# EasyEDA Pro project ProProject_quadcopter-FWB_2024-12-04.epro

# Schematic circuit_diagram_controller
Create Date: 2023-06-08; Page Name: diagram; Project Name: quadcopter-FWB; Schematic Name: circuit_diagram_controller; Update Date: 2023-06-11; Company: 嘉立创EDA; Page Size: A4; Version: V1.0
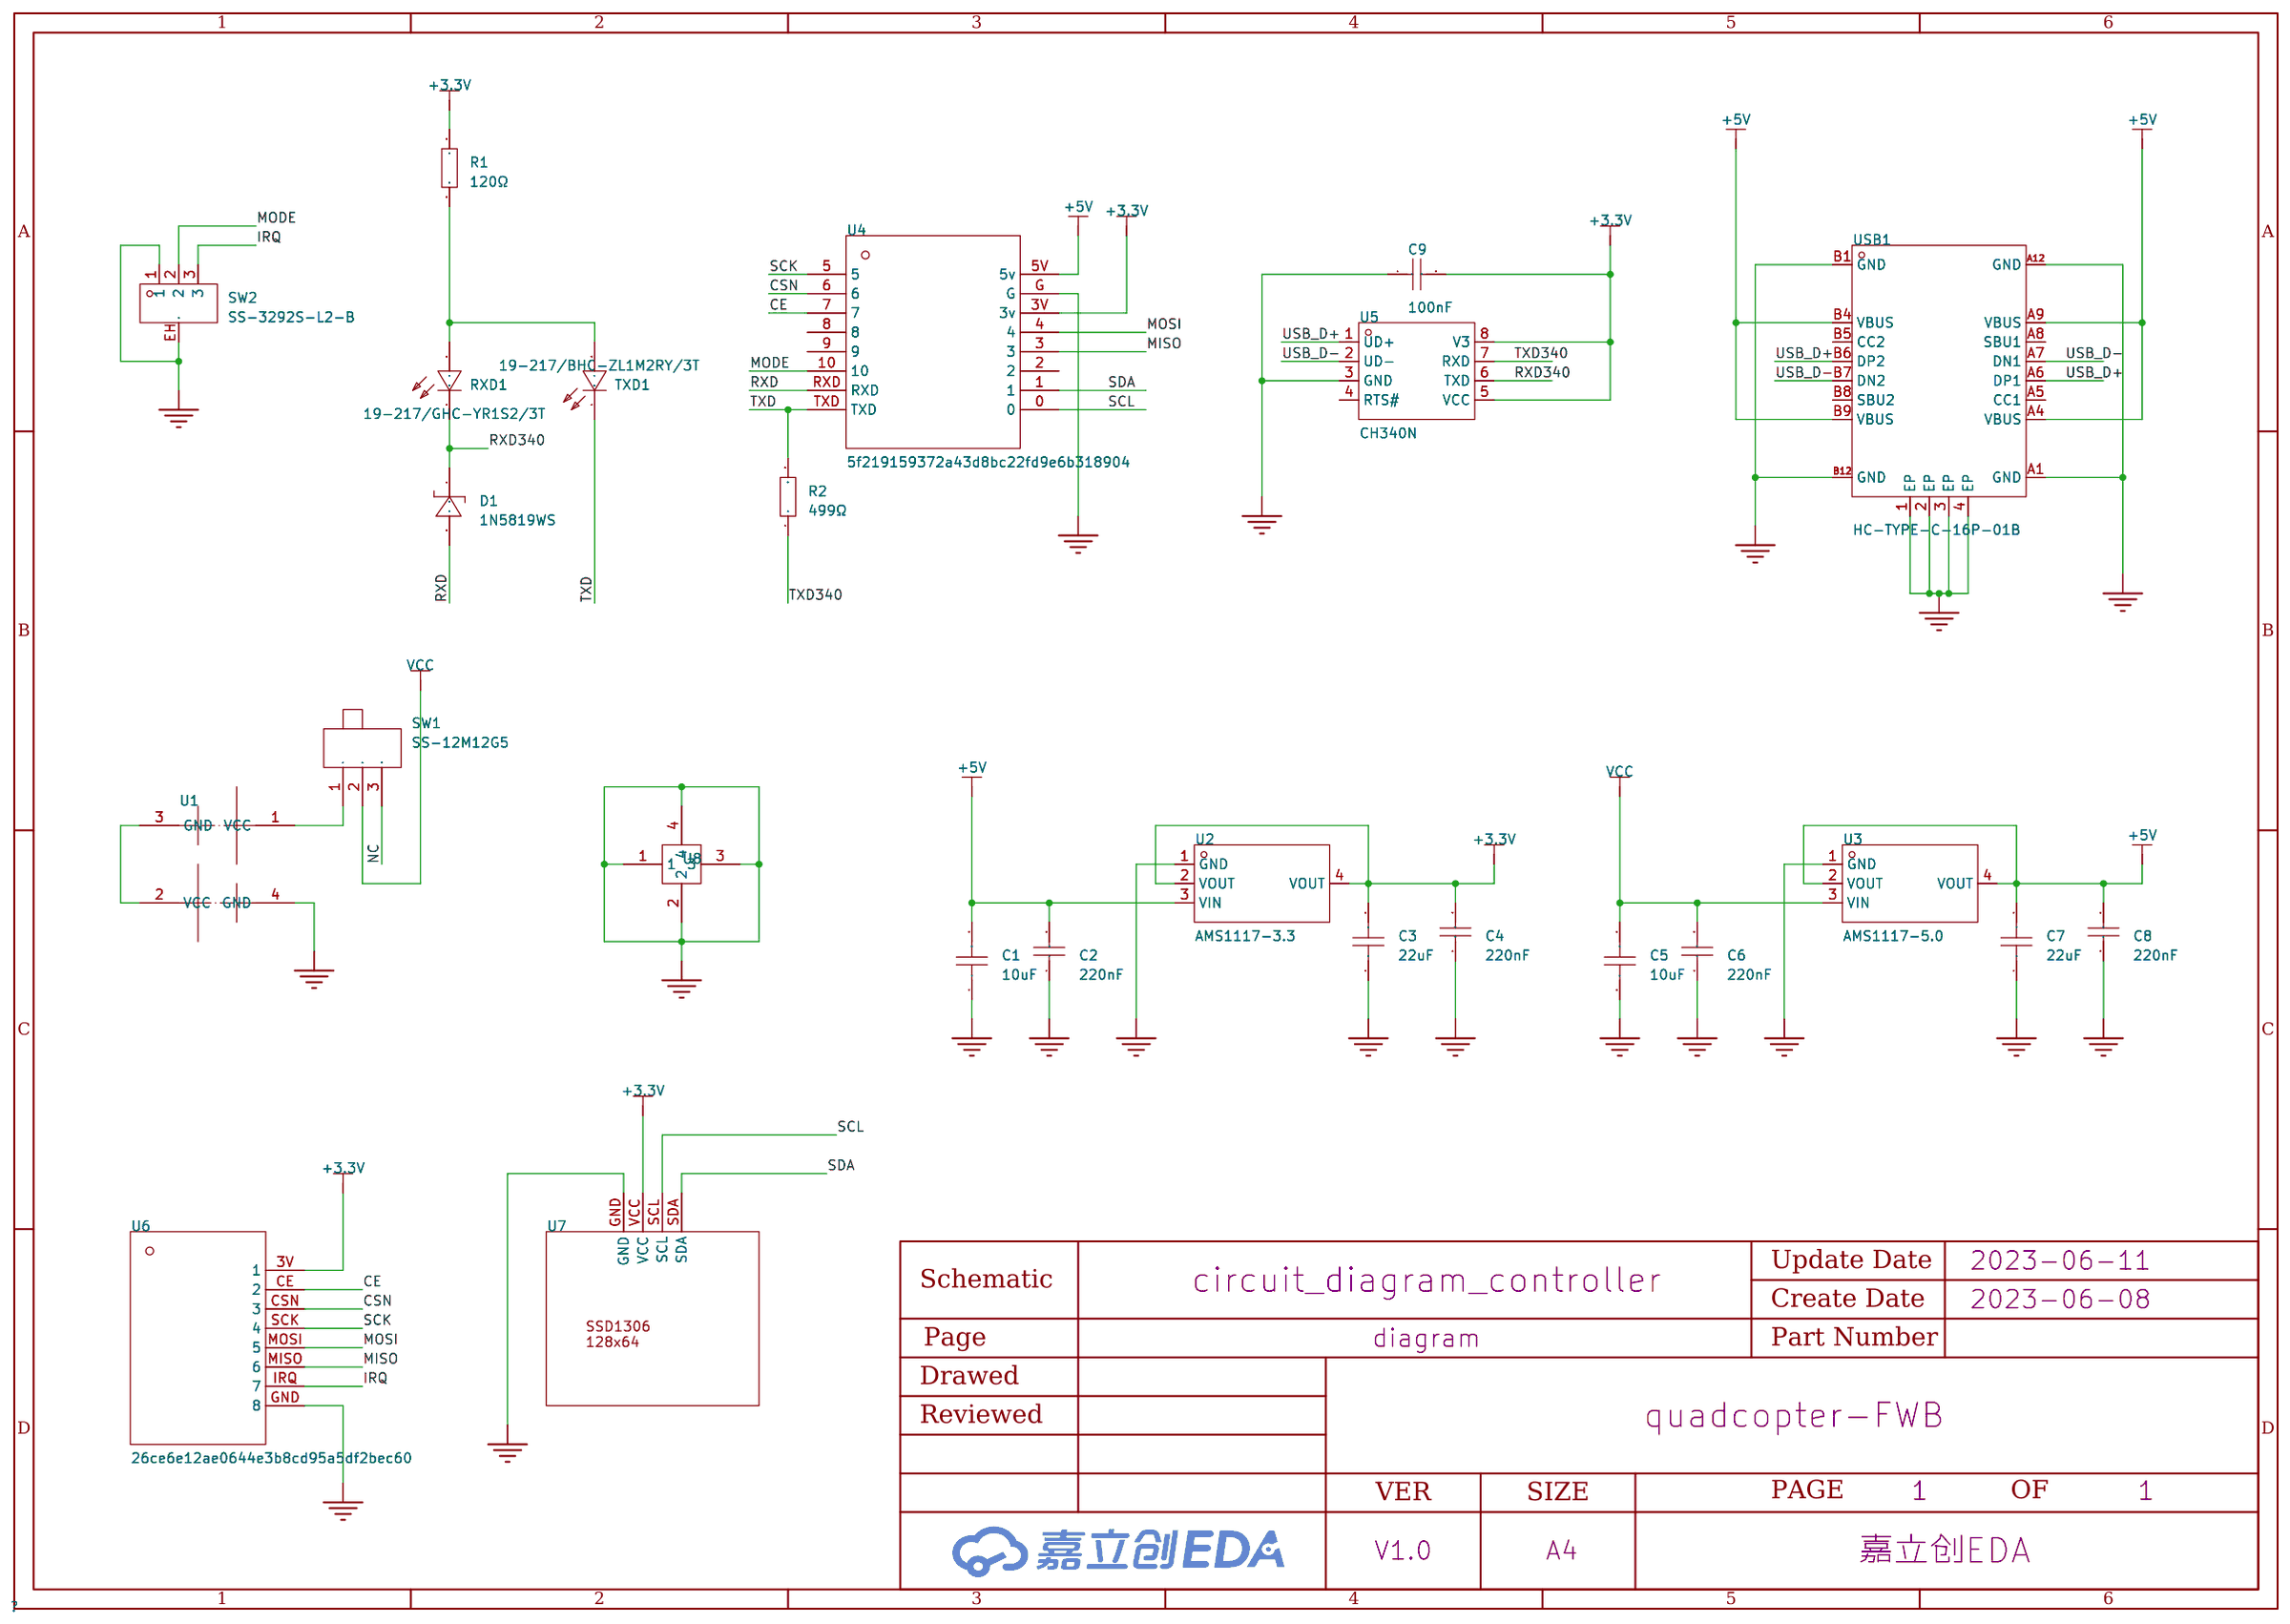
[diagram p0: schematic sheet]

## Parts
C1  10uF  [C0603]
C2  220nF  [C0603]
C3  22uF  [C0603]
C4  220nF  [C0603]
C5  10uF  [C0603]
C6  220nF  [C0603]
C7  22uF  [C0603]
C8  220nF  [C0603]
C9  100nF  [C0402]
D1  1N5819WS  [SOD-323_L1.8-W1.3-LS2.5-RD]
R1  120Ω  [R0603]
R2  499Ω  [R0603]
RXD1  19-217/GHC-YR1S2/3T  [LED0603-RD]
SW1  SS-12M12G5  [SW-TH_SS-12M12G5]
SW2  SS-3292S-L2-B  [SW-SMD_SS-3292S-L2-B]
TXD1  19-217/BHC-ZL1M2RY/3T  [LED0603-FD_BLUE]
U1  -  [AA battery]
U2  AMS1117-3.3  [SOT-223-3_L6.5-W3.4-P2.30-LS7.0-BR]
U3  AMS1117-5.0  [SOT-223_L6.5-W3.5-P2.30-LS7.0-BR]
U4  5f219159372a43d8bc22fd9e6b318904  [esp32c3-mini]
U5  CH340N  [SOP-8_L4.9-W3.9-P1.27-LS6.0-BL]
U6  26ce6e12ae0644e3b8cd95a5df2bec60  [nrf24l01p-mini]
U7  -  [oled-1.3-ssd1306]
U8  -  [2.4G Bluetooth antenna pedestal]
USB1  HC-TYPE-C-16P-01B  [USB-C-SMD_KH-TYPE-C-16P]

## Library data of the parts
C1 C5 = CL10A106KP8NNNC: 容值:10uF;精度:±10%;额定电压:10V;材质(温度系数):X5R;; LCSC Part Name: 10uF ±10% 10V; Supplier Part: C19702; Manufacturer: SAMSUNG(三星); Supplier Footprint: 0603; JLCPCB Part Class: Basic Part; Datasheet: https://atta.szlcsc.com/upload/public/pdf/source/20160103/1457707703378.pdf; Supplier: LCSC; Tolerance: ±10%; Voltage Rated: 10V; Temperature Coefficient: X5R
C2 C4 C6 C8 = CL10B224KA8NNNC: 容值:220nF;精度:±10%;额定电压:25V;材质(温度系数):X7R;; LCSC Part Name: 220nF ±10% 25V; Supplier Part: C21120; Manufacturer: SAMSUNG(三星); Supplier Footprint: 0603; JLCPCB Part Class: Basic Part; Datasheet: https://atta.szlcsc.com/upload/public/pdf/source/20160103/1457707705031.pdf; Supplier: LCSC; Tolerance: ±10%; Voltage Rated: 25V; Temperature Coefficient: X7R
C3 C7 = CL10A226MQ8NRNC: 容值:22uF;精度:±20%;额定电压:6.3V;材质(温度系数):X5R;; LCSC Part Name: 22uF ±20% 6.3V; Supplier Part: C59461; Manufacturer: SAMSUNG(三星); Supplier Footprint: 0603; JLCPCB Part Class: Basic Part; Datasheet: https://atta.szlcsc.com/upload/public/pdf/source/20160103/1457707740762.pdf; Supplier: LCSC; Tolerance: ±20%; Voltage Rated: 6.3V; Temperature Coefficient: X5R
C9 = CL05B104KO5NNNC: 容值:100nF;精度:±10%;额定电压:16V;材质(温度系数):X7R;; LCSC Part Name: 100nF ±10% 16V; Supplier Part: C1525; Manufacturer: SAMSUNG(三星); Supplier Footprint: 0402; JLCPCB Part Class: Basic Part; Datasheet: https://atta.szlcsc.com/upload/public/pdf/source/20160103/1457707674891.pdf; Supplier: LCSC; Tolerance: ±10%; Voltage Rated: 16V; Temperature Coefficient: X7R
D1 = 1N5819WS_C191023: 直流反向耐压(Vr):40V;平均整流电流(Io):1A;正向压降(Vf):600mV@1A;; LCSC Part Name: 40V 1A 600mV@1A; Supplier Part: C191023; Manufacturer: Hottech(合科泰); Supplier Footprint: SOD-323; JLCPCB Part Class: Basic Part; Datasheet: https://atta.szlcsc.com/upload/public/pdf/source/20220428/3CB86FD8D28D653594B4E35F9D5AEFD9.pdf; Supplier: LCSC; Reverse Voltage (Vr): 40V; Average Rectified Current (Io): 1A; Forward Voltage (Vf@If): 600mV@1A
R1 = 0603WAF1200T5E: 电阻类型:厚膜电阻;阻值:120Ω;精度:±1%;功率:100mW;; LCSC Part Name: 120Ω ±1% 100mW; Supplier Part: C22787; Manufacturer: UNI-ROYAL(厚声); Supplier Footprint: 0603; JLCPCB Part Class: Basic Part; Datasheet: https://atta.szlcsc.com/upload/public/pdf/source/20200306/C422600_1E6D84923E4A46A82E41ADD87F860B5C.pdf; Supplier: LCSC; Type: 厚膜电阻; Tolerance: ±1%; Power(Watts): 100mW; Temperature Coefficient: ±100ppm/℃; Overload Voltage (Max): 75V; Operating Temperature Range: -55℃~+155℃
R2 = 0603WAF4990T5E: 电阻类型:厚膜电阻;阻值:499Ω;精度:±1%;功率:100mW;; LCSC Part Name: 499Ω ±1% 100mW; Supplier Part: C23065; Manufacturer: UNI-ROYAL(厚声); Supplier Footprint: 0603; JLCPCB Part Class: Extended Part; Datasheet: https://atta.szlcsc.com/upload/public/pdf/source/20200306/C422600_1E6D84923E4A46A82E41ADD87F860B5C.pdf; Supplier: LCSC; Type: 厚膜电阻; Tolerance: ±1%; Power(Watts): 100mW; Temperature Coefficient: ±100ppm/℃; Overload Voltage (Max): 75V; Operating Temperature Range: -55℃~+155℃
RXD1 = 19-217/GHC-YR1S2/3T: 发光颜色:翠绿;二极管配置:-;主波长:520nm~535nm;色温:-;功率:110mW;安装方式:-;; Supplier Part: C72043; Manufacturer: EVERLIGHT(亿光); Supplier Footprint: 0603; JLCPCB Part Class: Basic Part; Datasheet: https://atta.szlcsc.com/upload/public/pdf/source/20160507/1462613613780.pdf; Supplier: LCSC; Emitted Color: 翠绿; Lens Color: 无色透明; Dominant Wavelength: 520nm~535nm; Peak Wavelength: 518nm; Forward Current: 20mA; Power Dissipation: 110mW; Viewing Angle: 120°; Operating Temperature: -40℃~+85℃
SW1 = SS-12M12G5: 额定电流(DC):6A;额定电压(DC):120V;额定电流(AC):6A;额定电压(AC):120V;电路结构:单刀双掷;安装方式:弯插;机械寿命:1万次;开关颜色:黑色;; LCSC Part Name: 柄长5mm 弯插双档 滑动开关; Supplier Part: C2884789; Manufacturer: XKB Connectivity(中国星坤); Supplier Footprint: 插件; JLCPCB Part Class: Extended Part; Datasheet: https://atta.szlcsc.com/upload/public/pdf/source/20211009/F44B934214AE410D67AA0A05A88FD376.pdf; Supplier: LCSC; Current Rating (DC): 6A; Voltage Rating (DC): 120V; Current Rating (AC): 6A; Voltage Rating (AC): 120V; Circuit: 单刀双掷; Mounting Style: 弯插; Mechanical Life: 1万次; Actuator Color: 黑色; Actuator Style: 矩形柱状; Pin Style: PC引脚; Operating Temperature: -40℃~+85℃; Switch Length: 13.2mm; Switch Width: 7.2mm; Switch Height: 6.6mm
SW2 = SS-3292S-L2-B: 额定电流(DC):50mA;额定电压(DC):12V;额定电流(AC):50mA;额定电压(AC):12V;电路结构:单刀双掷;安装方式:卧贴;机械寿命:1万次;开关颜色:黑色;; LCSC Part Name: 柄长2mm 卧贴双档 滑动开关; Supplier Part: C500057; Manufacturer: XKB Connectivity(中国星坤); Supplier Footprint: SMD; JLCPCB Part Class: Extended Part; Datasheet: https://atta.szlcsc.com/upload/public/pdf/source/20211009/537369D6D18B021A8BA9BB670E121839.pdf; Supplier: LCSC; Current Rating (DC): 50mA; Voltage Rating (DC): 12V; Current Rating (AC): 50mA; Voltage Rating (AC): 12V; Circuit: 单刀双掷; Mounting Style: 卧贴; Mechanical Life: 1万次; Actuator Color: 黑色; Actuator Style: 矩形柱状; Pin Style: SMD接片; Operating Temperature: -40℃~+85℃; Switch Length: 6.75mm; Switch Width: 8.8mm; Switch Height: 1.4mm
TXD1 = 19-217/BHC-ZL1M2RY/3T: 发光颜色:蓝灯;二极管配置:-;主波长:465nm~475nm;色温:-;功率:110mW;安装方式:-;; LCSC Part Name: 蓝灯; Supplier Part: C72041; Manufacturer: EVERLIGHT(亿光); Supplier Footprint: 0603; JLCPCB Part Class: Basic Part; Datasheet: https://atta.szlcsc.com/upload/public/pdf/source/20170116/1484561237273.pdf; Supplier: LCSC; Emitted Color: 蓝灯; Lens Color: 无色透明; Dominant Wavelength: 465nm~475nm; Peak Wavelength: 468nm; Forward Current: 5mA; Power Dissipation: 110mW; Viewing Angle: 120°; Operating Temperature: -40℃~+85℃
U1 = AA battery: AA battery, 14500 battery, x2
U2 = AMS1117-3.3_C6186: 输出类型:固定;输出极性:正;最大输入电压:-;输出电压:3.3V;输出电流:1A;电源纹波抑制比(PSRR):72dB@(120Hz);; LCSC Part Name: 输出3.3V 1A; Supplier Part: C6186; Manufacturer: AMS; Supplier Footprint: SOT-223; JLCPCB Part Class: Basic Part; Datasheet: https://atta.szlcsc.com/upload/public/pdf/source/20180727/C6186_7A095716F0823C02F1997A905E26C086.pdf; Supplier: LCSC; Output Type: 固定; Output Polarity: 正; Number of Outputs: 1; Output Voltage: 3.3V; Dropout Voltage: 1.3V@(800mA); Output Current: 1A; Power Supply Rejection Ratio (PSRR): 72dB@(120Hz)
U3 = AMS1117-5.0_C6187: 输出类型:固定;输出极性:正;最大输入电压:15V;输出电压:5V;输出电流:1A;电源纹波抑制比(PSRR):68dB@(120Hz);; Supplier Part: C6187; Manufacturer: AMS; Supplier Footprint: SOT-223; JLCPCB Part Class: Basic Part; Datasheet: https://atta.szlcsc.com/upload/public/pdf/source/20180727/C6186_7A095716F0823C02F1997A905E26C086.pdf; Supplier: LCSC; Output Type: 固定; Output Polarity: 正; Number of Outputs: 1; Maximum Input Voltage: 15V; Output Voltage: 5V; Dropout Voltage: 1.3V@(1A); Output Current: 1A; Power Supply Rejection Ratio (PSRR): 68dB@(120Hz)
U4 = esp32c3-mini: esp32c3-mini No-logo
U5 = CH340N: LCSC Part Name: USB转串口芯片 CH340; Supplier Part: C2977777; Manufacturer: WCH(南京沁恒); Supplier Footprint: SOP-8; JLCPCB Part Class: Extended Part; Datasheet: https://atta.szlcsc.com/upload/public/pdf/source/20220223/82A45E4FF89B3EDCAD50B354450A7EF4.pdf; Supplier: LCSC
U6 = nrf24l01p-mini: nrf24l01p-mini with ipex pedestal
U7 = oled-1.3-ssd1306: 1.3 oled ssd1306 128x64
U8 = 2.4G Bluetooth antenna pedestal: For 2.4G, Bluetooth. / Q serie SMA pedestal
USB1 = HC-TYPE-C-16P-01B: 连接器类型:Type-C;标准:-;公母:母座;触点数量:16;端口数量:1;安装方式:卧贴;额定电流 - 电源:3A;触头材质:铜;触头镀层:金;工作温度范围:-25℃~+85℃;焊接温度(最大值):260℃;; LCSC Part Name: Type-C 母座 卧贴; Supplier Part: C2894898; Manufacturer: HCTL(华灿天禄); Supplier Footprint: SMD; JLCPCB Part Class: Extended Part; Datasheet: https://atta.szlcsc.com/upload/public/pdf/source/20221116/A0A1FBB0E7A834DC9555AEBAA987625F.pdf; Supplier: LCSC; Connector Type: Type-C; Gender: 母座; Number of Contacts: 16; Number of Ports: 1; Mounting Style: 卧贴; Current Rating - Power (Max): 3A; Contact Material: 铜; Contact Plating: 金; Operating Temperature Range: -25℃~+85℃; Welding Temperature (Max): 260℃

## Nets
+3.3V: C3.2 C4.2 C9.2 R1.2 U2.2(VOUT) U2.4(VOUT) U4.3V(3v) U5.5(VCC) U5.8(V3) U6.3V(1) U7.VCC
+5V: C1.2 C2.2 C7.2 C8.2 U2.3(VIN) U3.2(VOUT) U3.4(VOUT) U4.5V(5v) USB1.A4(VBUS) USB1.A9(VBUS) USB1.B4(VBUS) USB1.B9(VBUS)
GND: C1.1 C2.1 C3.1 C4.1 C5.1 C6.1 C7.1 C8.1 C9.1 SW2.1 SW2.EH U1.4(GND) U2.1(GND) U3.1(GND) U4.G U5.3(GND) U6.GND(8) U7.GND U8.1 U8.2 U8.3 U8.4 USB1.1(EP) USB1.2(EP) USB1.3(EP) USB1.4(EP) USB1.A1(GND) USB1.A12(GND) USB1.B1(GND) USB1.B12(GND)
VCC: C5.2 C6.2 SW1.2 U3.3(VIN)
CE: U4.7 U6.CE(2)
CSN: U4.6 U6.CSN(3)
IRQ: SW2.3 U6.IRQ(7)
MISO: U4.3 U6.MISO(6)
MODE: SW2.2 U4.10
MOSI: U4.4 U6.MOSI(5)
NC: SW1.3
RXD: D1.2(A) U4.RXD
RXD340: D1.1(C) RXD1.1(C) U5.6(TXD)
SCK: U4.5 U6.SCK(4)
SCL: U4.0 U7.SCL
SDA: U4.1 U7.SDA
TXD: R2.2 TXD1.1(C) U4.TXD
TXD340: R2.1 U5.7(RXD)
USB_D+: U5.1(UD+) USB1.A6(DP1) USB1.B6(DP2)
USB_D-: U5.2(UD-) USB1.A7(DN1) USB1.B7(DN2)
$1N20954: U1.2(VCC) U1.3(GND)
$1N23859: SW1.1 U1.1(VCC)
$1N25890: R1.1 RXD1.2(A) TXD1.2(A)

Not connected (* = marked no-connect by the designer): U4 2 8 9; U5 4(RTS#); USB1 A5(CC1) A8(SBU1) B5(CC2) B8(SBU2)

# Schematic circuit_diagram_receiver
Create Date: 2023-06-08; Page Name: diagram; Project Name: quadcopter-FWB; Schematic Name: circuit_diagram_receiver; Update Date: 2023-07-22; Company: 嘉立创EDA; Page Size: A4; Version: V1.0
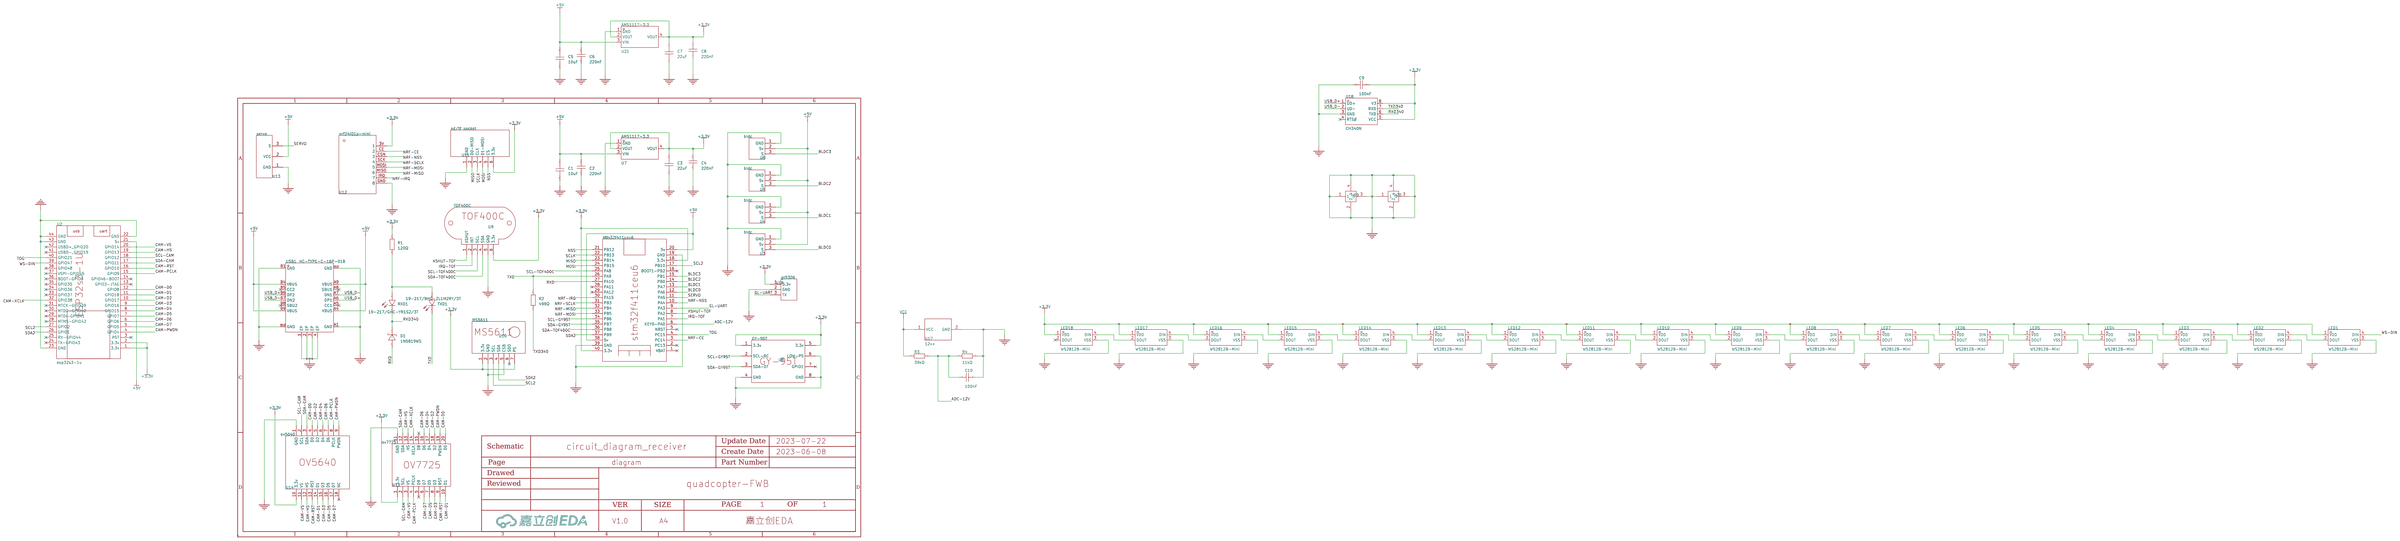
[diagram p1: schematic sheet]

## Parts
C1  10uF  [C0603]
C2  220nF  [C0603]
C3  22uF  [C0603]
C4  220nF  [C0603]
C5  10uF  [C0603]
C6  220nF  [C0603]
C7  22uF  [C0603]
C8  220nF  [C0603]
C9  100nF  [C0402]
C10  100nF  [C0402]
D1  1N5819WS  [SOD-323_L1.8-W1.3-LS2.5-RD]
LED1  WS2812B-Mini  [LED-SMD_4P-L3.5-W3.5-TL_WS2812B]
LED2  WS2812B-Mini  [LED-SMD_4P-L3.5-W3.5-TL_WS2812B]
LED3  WS2812B-Mini  [LED-SMD_4P-L3.5-W3.5-TL_WS2812B]
LED4  WS2812B-Mini  [LED-SMD_4P-L3.5-W3.5-TL_WS2812B]
LED5  WS2812B-Mini  [LED-SMD_4P-L3.5-W3.5-TL_WS2812B]
LED6  WS2812B-Mini  [LED-SMD_4P-L3.5-W3.5-TL_WS2812B]
LED7  WS2812B-Mini  [LED-SMD_4P-L3.5-W3.5-TL_WS2812B]
LED8  WS2812B-Mini  [LED-SMD_4P-L3.5-W3.5-TL_WS2812B]
LED9  WS2812B-Mini  [LED-SMD_4P-L3.5-W3.5-TL_WS2812B]
LED10  WS2812B-Mini  [LED-SMD_4P-L3.5-W3.5-TL_WS2812B]
LED11  WS2812B-Mini  [LED-SMD_4P-L3.5-W3.5-TL_WS2812B]
LED12  WS2812B-Mini  [LED-SMD_4P-L3.5-W3.5-TL_WS2812B]
LED13  WS2812B-Mini  [LED-SMD_4P-L3.5-W3.5-TL_WS2812B]
LED14  WS2812B-Mini  [LED-SMD_4P-L3.5-W3.5-TL_WS2812B]
LED15  WS2812B-Mini  [LED-SMD_4P-L3.5-W3.5-TL_WS2812B]
LED16  WS2812B-Mini  [LED-SMD_4P-L3.5-W3.5-TL_WS2812B]
LED17  WS2812B-Mini  [LED-SMD_4P-L3.5-W3.5-TL_WS2812B]
LED18  WS2812B-Mini  [LED-SMD_4P-L3.5-W3.5-TL_WS2812B]
R1  120Ω  [R0603]
R2  499Ω  [R0603]
R3  39kΩ  [R0805]
R4  11kΩ  [R0805]
RXD1  19-217/GHC-YR1S2/3T  [LED0603-RD]
TXD1  19-217/BHC-ZL1M2RY/3T  [LED0603-FD_BLUE]
U1  stm32f411ceu6  [stm32f411ceu6]
U2  esp32s3-1u  [esp32s3-1U]
U3  bldc  [ESC]
U4  bldc  [ESC]
U5  bldc  [ESC]
U6  bldc  [ESC]
U7  AMS1117-3.3  [SOT-223-3_L6.5-W3.4-P2.30-LS7.0-BR]
U8  GY-95T  [GY-95T]
U9  TOF400C  [TOF400C]
U10  MS5611  [MS5611]
U11  sd/tf socket  [sd-tf]
U12  nrf24l01p-mini  [nrf24l01p-mini]
U13  servo  [servo]
U14  ov5640  [ov5640]
U15  ov7725  [ov7725]
U16  gl9306  [gl9306]
U17  12v+  [voltage 12v+]
U18  CH340N  [SOP-8_L4.9-W3.9-P1.27-LS6.0-BL]
U19  -  [2.4G Bluetooth antenna pedestal]
U20  -  [2.4G Bluetooth antenna pedestal]
U21  AMS1117-3.3  [SOT-223-3_L6.5-W3.4-P2.30-LS7.0-BR]
USB1  HC-TYPE-C-16P-01B  [USB-C-SMD_KH-TYPE-C-16P]

## Library data of the parts
C1 C5 = CL10A106KP8NNNC: 容值:10uF;精度:±10%;额定电压:10V;材质(温度系数):X5R;; LCSC Part Name: 10uF ±10% 10V; Supplier Part: C19702; Manufacturer: SAMSUNG(三星); Supplier Footprint: 0603; JLCPCB Part Class: Basic Part; Datasheet: https://atta.szlcsc.com/upload/public/pdf/source/20160103/1457707703378.pdf; Supplier: LCSC; Tolerance: ±10%; Voltage Rated: 10V; Temperature Coefficient: X5R
C2 C4 C6 C8 = CL10B224KA8NNNC: 容值:220nF;精度:±10%;额定电压:25V;材质(温度系数):X7R;; LCSC Part Name: 220nF ±10% 25V; Supplier Part: C21120; Manufacturer: SAMSUNG(三星); Supplier Footprint: 0603; JLCPCB Part Class: Basic Part; Datasheet: https://atta.szlcsc.com/upload/public/pdf/source/20160103/1457707705031.pdf; Supplier: LCSC; Tolerance: ±10%; Voltage Rated: 25V; Temperature Coefficient: X7R
C3 C7 = CL10A226MQ8NRNC: 容值:22uF;精度:±20%;额定电压:6.3V;材质(温度系数):X5R;; LCSC Part Name: 22uF ±20% 6.3V; Supplier Part: C59461; Manufacturer: SAMSUNG(三星); Supplier Footprint: 0603; JLCPCB Part Class: Basic Part; Datasheet: https://atta.szlcsc.com/upload/public/pdf/source/20160103/1457707740762.pdf; Supplier: LCSC; Tolerance: ±20%; Voltage Rated: 6.3V; Temperature Coefficient: X5R
C9 C10 = CL05B104KO5NNNC: 容值:100nF;精度:±10%;额定电压:16V;材质(温度系数):X7R;; LCSC Part Name: 100nF ±10% 16V; Supplier Part: C1525; Manufacturer: SAMSUNG(三星); Supplier Footprint: 0402; JLCPCB Part Class: Basic Part; Datasheet: https://atta.szlcsc.com/upload/public/pdf/source/20160103/1457707674891.pdf; Supplier: LCSC; Tolerance: ±10%; Voltage Rated: 16V; Temperature Coefficient: X7R
D1 = 1N5819WS_C191023: 直流反向耐压(Vr):40V;平均整流电流(Io):1A;正向压降(Vf):600mV@1A;; LCSC Part Name: 40V 1A 600mV@1A; Supplier Part: C191023; Manufacturer: Hottech(合科泰); Supplier Footprint: SOD-323; JLCPCB Part Class: Basic Part; Datasheet: https://atta.szlcsc.com/upload/public/pdf/source/20220428/3CB86FD8D28D653594B4E35F9D5AEFD9.pdf; Supplier: LCSC; Reverse Voltage (Vr): 40V; Average Rectified Current (Io): 1A; Forward Voltage (Vf@If): 600mV@1A
LED1-LED18 = WS2812B-Mini_C527089: 发光颜色:RGB三色;二极管配置:-;主波长:472nm；518nm；622nm;色温:-;功率:-;安装方式:-;; LCSC Part Name: RGB三色 （注意防潮，请查阅规格书中对应具体内容）; Supplier Part: C527089; Manufacturer: worldsemi; Supplier Footprint: SMD3535; JLCPCB Part Class: Extended Part; Datasheet: https://atta.szlcsc.com/upload/public/pdf/source/20190620/C114583_ECCAEB884D1CBA01F5696FFC90F90D84.pdf; Supplier: LCSC; Emitted Color: RGB三色; Dominant Wavelength: 472nm；518nm；622nm; Forward Current: 12mA
R1 = 0603WAF1200T5E: 电阻类型:厚膜电阻;阻值:120Ω;精度:±1%;功率:100mW;; LCSC Part Name: 120Ω ±1% 100mW; Supplier Part: C22787; Manufacturer: UNI-ROYAL(厚声); Supplier Footprint: 0603; JLCPCB Part Class: Basic Part; Datasheet: https://atta.szlcsc.com/upload/public/pdf/source/20200306/C422600_1E6D84923E4A46A82E41ADD87F860B5C.pdf; Supplier: LCSC; Type: 厚膜电阻; Tolerance: ±1%; Power(Watts): 100mW; Temperature Coefficient: ±100ppm/℃; Overload Voltage (Max): 75V; Operating Temperature Range: -55℃~+155℃
R2 = 0603WAF4990T5E: 电阻类型:厚膜电阻;阻值:499Ω;精度:±1%;功率:100mW;; LCSC Part Name: 499Ω ±1% 100mW; Supplier Part: C23065; Manufacturer: UNI-ROYAL(厚声); Supplier Footprint: 0603; JLCPCB Part Class: Extended Part; Datasheet: https://atta.szlcsc.com/upload/public/pdf/source/20200306/C422600_1E6D84923E4A46A82E41ADD87F860B5C.pdf; Supplier: LCSC; Type: 厚膜电阻; Tolerance: ±1%; Power(Watts): 100mW; Temperature Coefficient: ±100ppm/℃; Overload Voltage (Max): 75V; Operating Temperature Range: -55℃~+155℃
R3 = 0805W8F3902T5E: 电阻类型:厚膜电阻;阻值:39kΩ;精度:±1%;功率:125mW;; LCSC Part Name: 39kΩ ±1% 125mW; Supplier Part: C25826; Manufacturer: UNI-ROYAL(厚声); Supplier Footprint: 0805; JLCPCB Part Class: Basic Part; Datasheet: https://atta.szlcsc.com/upload/public/pdf/source/20200306/C422600_1E6D84923E4A46A82E41ADD87F860B5C.pdf; Supplier: LCSC; Type: 厚膜电阻; Tolerance: ±1%; Power(Watts): 125mW; Temperature Coefficient: ±100ppm/℃; Overload Voltage (Max): 150V; Operating Temperature Range: -55℃~+155℃
R4 = 0805W8F1102T5E: 电阻类型:厚膜电阻;阻值:11kΩ;精度:±1%;功率:125mW;; LCSC Part Name: 11kΩ ±1% 125mW; Supplier Part: C17429; Manufacturer: UNI-ROYAL(厚声); Supplier Footprint: 0805; JLCPCB Part Class: Basic Part; Datasheet: https://atta.szlcsc.com/upload/public/pdf/source/20200306/C422600_1E6D84923E4A46A82E41ADD87F860B5C.pdf; Supplier: LCSC; Type: 厚膜电阻; Tolerance: ±1%; Power(Watts): 125mW; Temperature Coefficient: ±100ppm/℃; Overload Voltage (Max): 150V; Operating Temperature Range: -55℃~+155℃
RXD1 = 19-217/GHC-YR1S2/3T: 发光颜色:翠绿;二极管配置:-;主波长:520nm~535nm;色温:-;功率:110mW;安装方式:-;; Supplier Part: C72043; Manufacturer: EVERLIGHT(亿光); Supplier Footprint: 0603; JLCPCB Part Class: Basic Part; Datasheet: https://atta.szlcsc.com/upload/public/pdf/source/20160507/1462613613780.pdf; Supplier: LCSC; Emitted Color: 翠绿; Lens Color: 无色透明; Dominant Wavelength: 520nm~535nm; Peak Wavelength: 518nm; Forward Current: 20mA; Power Dissipation: 110mW; Viewing Angle: 120°; Operating Temperature: -40℃~+85℃
TXD1 = 19-217/BHC-ZL1M2RY/3T: 发光颜色:蓝灯;二极管配置:-;主波长:465nm~475nm;色温:-;功率:110mW;安装方式:-;; LCSC Part Name: 蓝灯; Supplier Part: C72041; Manufacturer: EVERLIGHT(亿光); Supplier Footprint: 0603; JLCPCB Part Class: Basic Part; Datasheet: https://atta.szlcsc.com/upload/public/pdf/source/20170116/1484561237273.pdf; Supplier: LCSC; Emitted Color: 蓝灯; Lens Color: 无色透明; Dominant Wavelength: 465nm~475nm; Peak Wavelength: 468nm; Forward Current: 5mA; Power Dissipation: 110mW; Viewing Angle: 120°; Operating Temperature: -40℃~+85℃
U1 = stm3f411ceu6: stm32f411ceu6 / https://www.taobao.com/list/item/594670660262.htm
U2 = esp32s3-1U: esp32s3-1U / Espressif original
U3-U6 = ESC: BLDC - ESC
U7 U21 = AMS1117-3.3_C6186: 输出类型:固定;输出极性:正;最大输入电压:-;输出电压:3.3V;输出电流:1A;电源纹波抑制比(PSRR):72dB@(120Hz);; LCSC Part Name: 输出3.3V 1A; Supplier Part: C6186; Manufacturer: AMS; Supplier Footprint: SOT-223; JLCPCB Part Class: Basic Part; Datasheet: https://atta.szlcsc.com/upload/public/pdf/source/20180727/C6186_7A095716F0823C02F1997A905E26C086.pdf; Supplier: LCSC; Output Type: 固定; Output Polarity: 正; Number of Outputs: 1; Output Voltage: 3.3V; Dropout Voltage: 1.3V@(800mA); Output Current: 1A; Power Supply Rejection Ratio (PSRR): 72dB@(120Hz)
U8 = GY-95T: GY-95T / https://item.taobao.com/item.htm?spm=a230r.1.14.3.5cf97728AJDp0f&id=651420247840&ns=1&abbucket=16#detail
U9 = TOF400C: TOF400C / https://detail.tmall.com/item.htm?_u=g203ahv8nm2dec&id=644538588142&skuId=4815650482992&spm=a1z09.2.0.0.4a312e8di9YLGU
U10 = MS5611: MS5611 / https://item.taobao.com/item.htm?spm=a230r.1.14.18.b6c14a1bNdboN7&id=522572301522&ns=1&abbucket=16#detail
U11 = sd-tf: https://detail.tmall.com/item.htm?ali_refid=a3_430582_1006:1109983619:N:zODacfKDyAbk3OWiQ31CJw==:211981d45faf1fa7db46d43eec3f7e23&ali_trackid=1_211981d45faf1fa7db46d43eec3f7e23&id=41337396998&spm=a230r.1.14.3&skuId=4367312818922
U12 = nrf24l01p-mini: nrf24l01p-mini with ipex pedestal
U13 = servo: servo with 3 wires / gnd vcc signal
U14 = ov5640: ov5640 / 24Mhz xclk
U15 = ov7725
U16 = gl9306: gl9306 mini / https://item.taobao.com/item.htm?spm=a230r.1.14.18.14c941b1AzSuRc&id=619276152927&ns=1&abbucket=16#detail
U17 = voltage 12v+: A output 12v+ for adc sampling, not a power source / It comes from a XT60 socket
U18 = CH340N: LCSC Part Name: USB转串口芯片 CH340; Supplier Part: C2977777; Manufacturer: WCH(南京沁恒); Supplier Footprint: SOP-8; JLCPCB Part Class: Extended Part; Datasheet: https://atta.szlcsc.com/upload/public/pdf/source/20220223/82A45E4FF89B3EDCAD50B354450A7EF4.pdf; Supplier: LCSC
U19 U20 = 2.4G Bluetooth antenna pedestal: For 2.4G, Bluetooth. / Q serie SMA pedestal
USB1 = HC-TYPE-C-16P-01B: 连接器类型:Type-C;标准:-;公母:母座;触点数量:16;端口数量:1;安装方式:卧贴;额定电流 - 电源:3A;触头材质:铜;触头镀层:金;工作温度范围:-25℃~+85℃;焊接温度(最大值):260℃;; LCSC Part Name: Type-C 母座 卧贴; Supplier Part: C2894898; Manufacturer: HCTL(华灿天禄); Supplier Footprint: SMD; JLCPCB Part Class: Extended Part; Datasheet: https://atta.szlcsc.com/upload/public/pdf/source/20221116/A0A1FBB0E7A834DC9555AEBAA987625F.pdf; Supplier: LCSC; Connector Type: Type-C; Gender: 母座; Number of Contacts: 16; Number of Ports: 1; Mounting Style: 卧贴; Current Rating - Power (Max): 3A; Contact Material: 铜; Contact Plating: 金; Operating Temperature Range: -25℃~+85℃; Welding Temperature (Max): 260℃

## Nets
+3.3V: C3.2 C4.2 C7.2 C8.2 C9.2 LED1.1(VDD) LED2.1(VDD) LED3.1(VDD) LED4.1(VDD) LED5.1(VDD) LED6.1(VDD) LED7.1(VDD) LED8.1(VDD) LED9.1(VDD) LED10.1(VDD) LED11.1(VDD) LED12.1(VDD) LED13.1(VDD) LED14.1(VDD) LED15.1(VDD) LED16.1(VDD) LED17.1(VDD) LED18.1(VDD) R1.2 U1.18(3.3v) U1.40(3.3v) U2.1(3.3v) U2.2(3.3v) U7.2(VOUT) U7.4(VOUT) U8.1(3.3v) U8.5(3.3v) U9.6(3.3v) U10.1(3.3v) U10.7(PS) U11.6(3.3v) U12.3V(1) U14.10(3.3v) U15.1(3.3v) U16.1(3.3v) U18.5(VCC) U18.8(V3) U21.2(VOUT) U21.4(VOUT)
+5V: C1.2 C2.2 C5.2 C6.2 U1.20(5v) U1.38(5v) U2.21(5v) U3.2(5v) U4.2(5v) U5.2(5v) U6.2(5v) U7.3(VIN) U13.2(VCC) U21.3(VIN) USB1.A4(VBUS) USB1.A9(VBUS) USB1.B4(VBUS) USB1.B9(VBUS)
GND: C1.1 C2.1 C3.1 C4.1 C5.1 C6.1 C7.1 C8.1 C9.1 C10.2 LED1.3(VSS) LED2.3(VSS) LED3.3(VSS) LED4.3(VSS) LED5.3(VSS) LED6.3(VSS) LED7.3(VSS) LED8.3(VSS) LED9.3(VSS) LED10.3(VSS) LED11.3(VSS) LED12.3(VSS) LED13.3(VSS) LED14.3(VSS) LED15.3(VSS) LED16.3(VSS) LED17.3(VSS) LED18.3(VSS) R4.2 U1.19(GND) U1.39(GND) U2.22(GND) U2.23(GND) U2.43(GND) U2.44(GND) U3.1(GND) U4.1(GND) U5.1(GND) U6.1(GND) U7.1(GND) U8.4(GND) U8.6(LOW-PS) U8.8(GND) U9.5(GND) U10.2(GND) U10.5(CSB) U11.1(GND) U12.GND(8) U13.1(GND) U14.1(GND) U15.11(GND) U16.2(GND) U17.2(GND) U18.3(GND) U19.1 U19.2 U19.3 U19.4 U20.1 U20.2 U20.3 U20.4 U21.1(GND) USB1.1(EP) USB1.2(EP) USB1.3(EP) USB1.4(EP) USB1.A1(GND) USB1.A12(GND) USB1.B1(GND) USB1.B12(GND)
VCC: R3.1 U17.1(VCC)
ADC-12V: C10.1 R3.2 R4.1 U1.6(KEY0-PA0)
BLDC0: U1.12(PA6) U3.3(S)
BLDC1: U1.13(PA7) U4.3(S)
BLDC2: U1.14(PB0) U5.3(S)
BLDC3: U1.15(PB1) U6.3(S)
CAM-D0: U2.12(GPIO8) U14.4(D0) U15.20(D0)
CAM-D1: U2.11(GPIO18) U14.14(D1) U15.10(D1)
CAM-D2: U2.10(GPIO17) U14.5(D2) U15.18(D2)
CAM-D3: U2.9(GPIO16) U14.15(D3) U15.8(D3)
CAM-D4: U2.8(GPIO15) U14.6(D4) U15.17(D4)
CAM-D5: U2.7(GPIO7) U14.16(D5) U15.7(D5)
CAM-D6: U2.6(GPIO6) U14.7(D6) U15.16(D6)
CAM-D7: U2.5(GPIO5) U14.17(D7) U15.6(D7)
CAM-HS: U2.19(GPIO13) U14.12(HS) U15.13(HS)
CAM-PCLK: U2.15(GPIO9) U14.8(PCLK) U15.4(PCLK)
CAM-PWDN: U2.4(GPIO4) U14.9(PWDN) U15.19(PWDN)
CAM-RST: U2.16(GPIO10) U14.13(RST) U15.9(RST)
CAM-VS: U2.20(GPIO14) U14.11(VS) U15.3(VS)
CAM-XCLK: U2.32(GPIO38) U15.14(XCLK)
GL-UART: U1.9(PA3) U16.3(TX)
IRQ-TOF: U1.7(PA1) U9.2(INT)
MISO: U1.23(PB14) U11.2(D0-MISO)
MOSI: U1.24(PB15) U11.4(D1-MOSI)
NRF-CE: U1.3(PC14) U12.CE(2)
NRF-IRQ: U1.30(PA15) U12.IRQ(7)
NRF-MISO: U1.32(PB4) U12.MISO(6)
NRF-MOSI: U1.33(PB5) U12.MOSI(5)
NRF-NSS: U1.10(PA4) U12.CSN(3)
NRF-SCLK: U1.31(PB3) U12.SCK(4)
NSS: U1.21(PB12) U11.5(CS)
RXD: D1.2(A) U1.27(PA10)
RXD340: D1.1(C) RXD1.1(C) U18.6(TXD)
SCL2: U1.17(PB10) U2.27(GPIO2) U10.3(SCL)
SCL-CAM: U2.18(GPIO12) U14.2(SCL) U15.2(SCL)
SCL-GY95T: U1.34(PB6) U8.2(SCL-RC)
SCL-TOF400C: U1.25(PA8) U9.3(SCL)
SCLK: U1.22(PB13) U11.3(CLK)
SDA2: U1.37(PB9) U2.26(GPIO1) U10.4(SDA)
SDA-CAM: U2.17(GPIO11) U14.3(SDA) U15.12(SDA)
SDA-GY95T: U1.35(PB7) U8.3(SDA-DT)
SDA-TOF400C: U1.36(PB8) U9.4(SDA)
SERVO: U1.11(PA5) U13.3(S)
TOG: U1.4(PC15) U2.40(GPIO21)
TXD: R2.2 TXD1.1(C) U1.26(PA9)
TXD340: R2.1 U18.7(RXD)
USB_D+: U18.1(UD+) USB1.A6(DP1) USB1.B6(DP2)
USB_D-: U18.2(UD-) USB1.A7(DN1) USB1.B7(DN2)
WS-DIN: LED1.4(DIN) U2.39(GPIO47)
XSHUT-TOF: U1.8(PA2) U9.1(XSHUT)
$1N3328: R1.1 RXD1.2(A) TXD1.2(A)
$1N23707: LED9.2(DOUT) LED10.4(DIN)
$1N23731: LED10.2(DOUT) LED11.4(DIN)
$1N23755: LED11.2(DOUT) LED12.4(DIN)
$1N23779: LED12.2(DOUT) LED13.4(DIN)
$1N23803: LED13.2(DOUT) LED14.4(DIN)
$1N23834: LED14.2(DOUT) LED15.4(DIN)
$1N23846: LED15.2(DOUT) LED16.4(DIN)
$1N28019: LED1.2(DOUT) LED2.4(DIN)
$1N28020: LED2.2(DOUT) LED3.4(DIN)
$1N28021: LED3.2(DOUT) LED4.4(DIN)
$1N28022: LED4.2(DOUT) LED5.4(DIN)
$1N28023: LED5.2(DOUT) LED6.4(DIN)
$1N28024: LED6.2(DOUT) LED7.4(DIN)
$1N28025: LED7.2(DOUT) LED8.4(DIN)
$1N29352: LED8.2(DOUT) LED9.4(DIN)
$1N31966: LED16.2(DOUT) LED17.4(DIN)
$1N32002: LED17.2(DOUT) LED18.4(DIN)

Not connected (* = marked no-connect by the designer): LED18 2(DOUT)*; U1 1(VBAT)* 2(PC13)* 5(NRST)* 16(BOOT1-PB2)* 28(PA11)* 29(PA12)*; U2 3(RST)* 13(GPIO3-JTAG)* 14(GPIO46-BOOT)* 24(TX-GPIO43)* 25(RX-GPIO44)* 28(MTMS-GPIO42)* 29(MTDI-GPIO41)* 30(MTDO-GPIO40)* 31(MTCK-GPIO39)* 33(GPIO37)* 34(GPIO36)* 35(GPIO35)* 36(BOOT-GPIO0)* 37(VSPI-GPIO45)* 38(GPIO48)* 41(USBD- GPIO19)* 42(USBD+ GPIO20)*; U8 7(GPIO1)*; U10 6(SDO)*; U14 18(NC)*; U15 5(D9)* 15(D8)*; U18 4(RTS#)*; USB1 A5(CC1)* A8(SBU1)* B5(CC2)* B8(SBU2)*

# Board pcb_controller
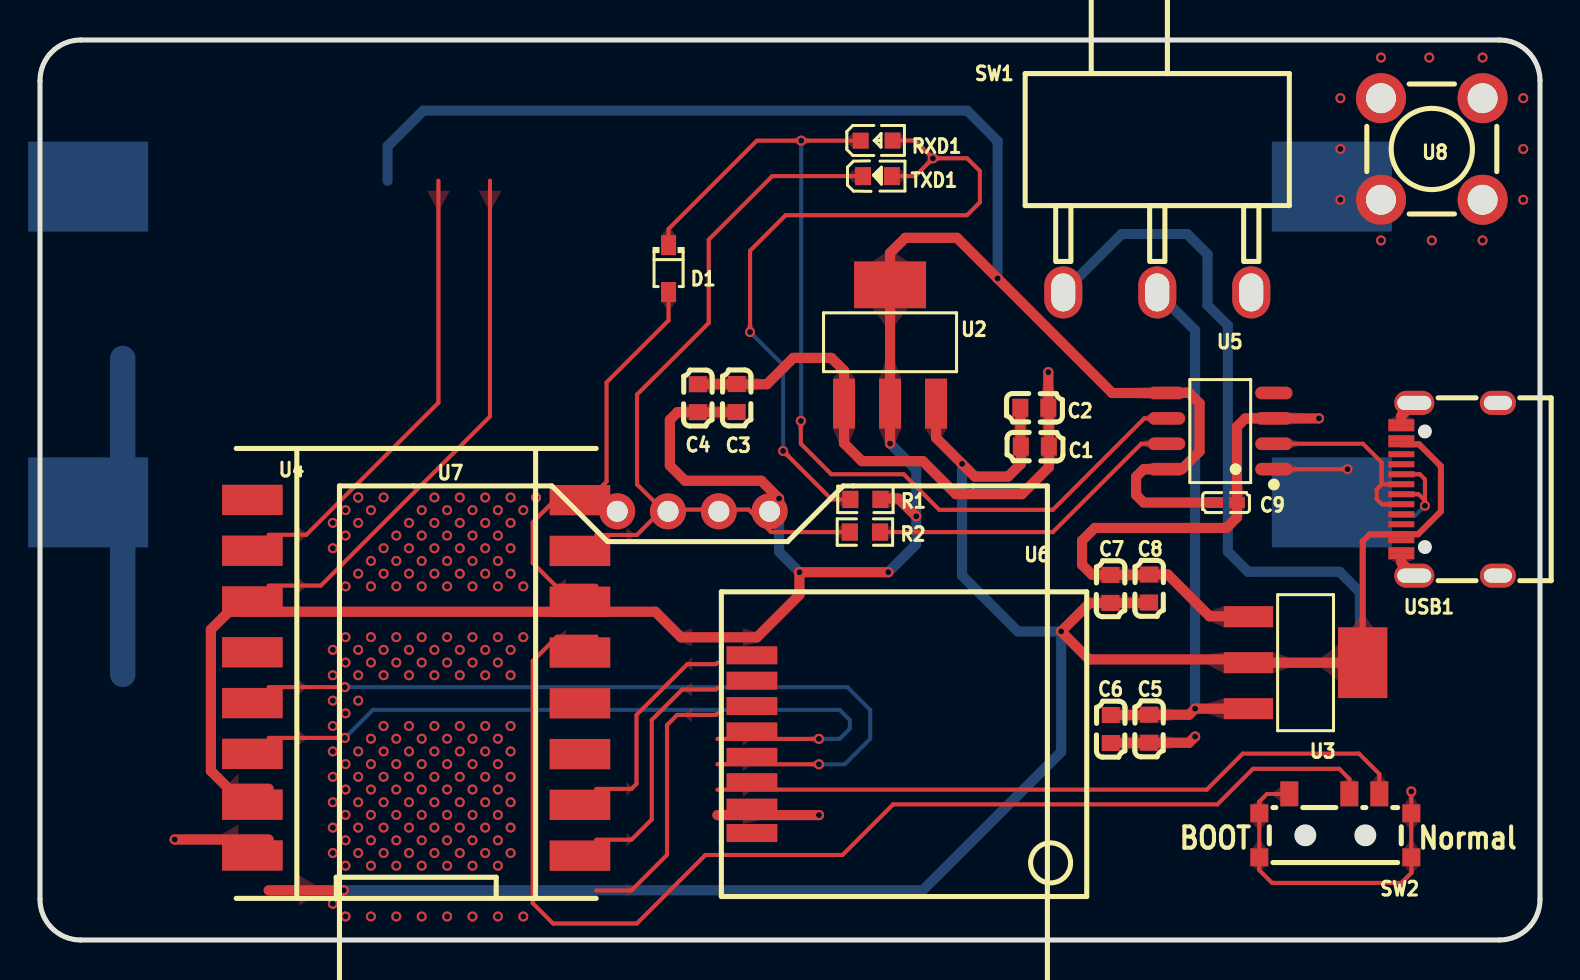
[diagram p2: board, top side]
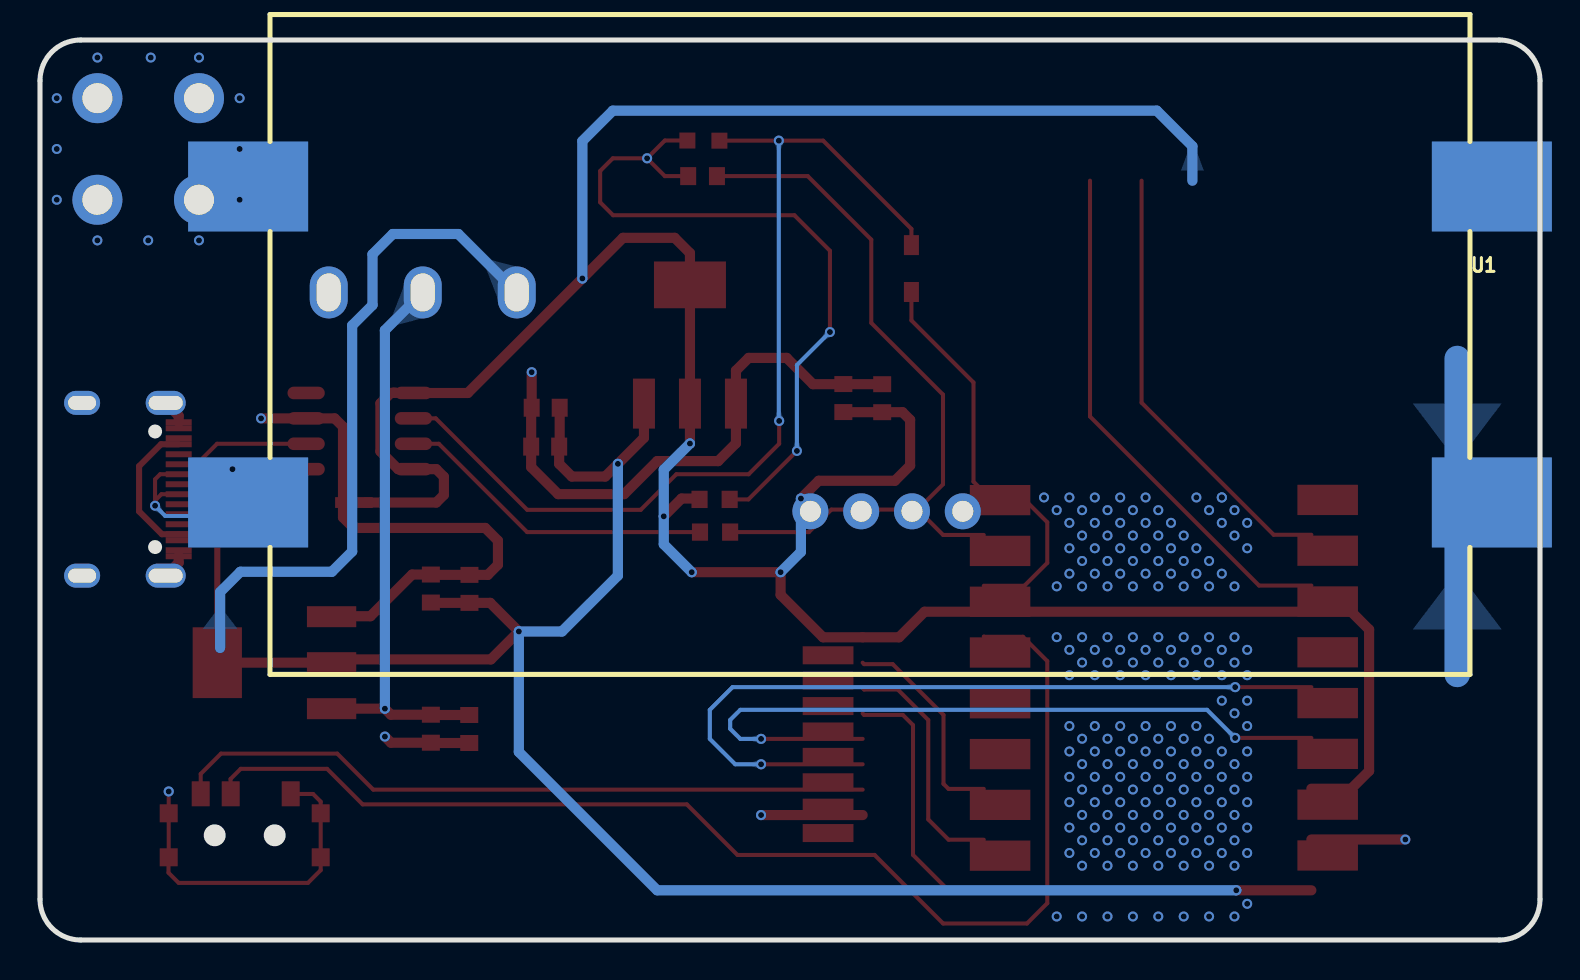
[diagram p3: board, bottom side, seen from below]

Outline 75.01 x 45.01 mm; copper layers: Top Layer, Bottom Layer. Coordinates in mm from the lower left corner of the outline.
Outline path: 0,42.98 0,2.03 arc(0.6,0.6) 2.03,0 72.97,0 arc(74.41,0.6) 75.01,2.03 75.01,42.98 arc(74.41,44.41) 72.97,45.01 2.03,45.01 arc(0.6,44.41) 0,42.98
Stack: Top Layer 0.035mm / Dielectric1 1.51mm FR4 er 4.5 / Bottom Layer 0.035mm

## Design rules (mm)
template: JLCPCB Capability(Two Layers Board)
spacing copperThickness1oz (default): track to track 0.102, other pairs 0.152 to 0.3
spacing copperThickness2oz: track to track 0.203, other pairs 0.152 to 0.3
track width copperThickness1oz (default): min 0.127, default 0.254, max 2.54
track width copperThickness2oz: min 0.203, default 0.254, max 2.54
differential pair differentialPair (default): width min 0.127, default 0.254, max 2.54; gap min 0.152, default 0.152
via viaSize (default): diameter min 0.5, default 0.61, max 10; hole min 0.3, default 0.305, max 6.3

## Placement (name value [footprint] x y rotation side)
C1  10uF  [C0603]  49.75 24.67 180 top
C2  220nF  [C0603]  49.72 26.62 180 top
C3  22uF  [C0603]  34.84 27.1 270 top
C4  220nF  [C0603]  32.89 27.1 270 top
C5  10uF  [C0603]  55.46 10.57 90 top
C6  220nF  [C0603]  53.54 10.55 90 top
C7  22uF  [C0603]  53.53 17.56 270 top
C8  220nF  [C0603]  55.46 17.58 270 top
C9  100nF  [C0402]  59.31 21.88 180 top
D1  1N5819WS  [SOD-323_L1.8-W1.3-LS2.5-RD]  31.43 33.58 270 top
R1  120Ω  [R0603]  41.27 22.03 0 top
R2  499Ω  [R0603]  41.25 20.4 180 top
RXD1  19-217/GHC-YR1S2/3T  [LED0603-RD]  41.83 39.98 0 top
SW1  SS-12M12G5  [SW-TH_SS-12M12G5]  55.87 32.39 0 top
SW2  SS-3292S-L2-B  [SW-SMD_SS-3292S-L2-B]  64.77 5.72 0 top
TXD1  19-217/BHC-ZL1M2RY/3T  [LED0603-FD_BLUE]  41.88 38.2 0 top
U1  -  [AA battery]  3.5 13.28 0 bottom
U2  AMS1117-3.3  [SOT-223-3_L6.5-W3.4-P2.30-LS7.0-BR]  42.51 29.79 270 top
U3  AMS1117-5.0  [SOT-223_L6.5-W3.5-P2.30-LS7.0-BR]  63.28 13.87 180 top
U4  5f219159372a43d8bc22fd9e6b318904  [esp32c3-mini]  27.81 2.48 180 top
U5  CH340N  [SOP-8_L4.9-W3.9-P1.27-LS6.0-BL]  59.02 25.45 90 top
U6  26ce6e12ae0644e3b8cd95a5df2bec60  [nrf24l01p-mini]  33.87 15.14 270 top
U7  -  [oled-1.3-ssd1306]  18.67 22.71 0 top
U8  -  [2.4G Bluetooth antenna pedestal]  69.6 39.56 0 top
USB1  HC-TYPE-C-16P-01B  [USB-C-SMD_KH-TYPE-C-16P]  70.49 22.54 90 top

## Footprints (pads in the part's own frame, mm; a bottom-side part is the same pattern mirrored in y, then rotated)
2.4G Bluetooth antenna pedestal
  round 2.5 hole 1.5: 1(-2.54,-2.54) 2(-2.54,2.54) 3(2.54,2.54) 4(2.54,-2.54)
AA battery
  custom 6x4.5 smd: 1(61.095,-8.6) 2(-1.095,-24.4) 3(-1.095,-8.6) 4(61.095,-24.4)
C0402
  rect 0.79x0.54 smd: 1(-0.545,0) 2(0.545,0)
C0603
  rect 0.8x0.9 smd: 1(-0.7,0) 2(0.7,0)
esp32c3-mini
  custom 3.028x1.514 smd: 0(17.195,-19.532) 1(17.195,-16.992) 2(17.195,-14.453) 3(17.195,-11.912) 3V(17.195,-6.832) 4(17.195,-9.373) 5(0.815,-1.742) 5V(17.195,-1.752) 6(0.815,-4.282) 7(0.815,-6.822) 8(0.815,-9.362) 9(0.815,-11.902) 10(0.815,-14.442) G(17.195,-4.293) RXD(0.815,-16.982) TXD(0.815,-19.522)
LED0603-FD_BLUE
  rect 0.8x0.9 smd: 1(-0.72,0) 2(0.72,0)
LED0603-RD
  rect 0.8x0.8 smd: 1(-0.799,-0.004) 2(0.799,0.004)
nrf24l01p-mini
  custom 0.9x2.54 smd: 3V(0.9,1.728) CE(2.17,1.728) CSN(3.44,1.728) GND(9.79,1.728) IRQ(8.52,1.728) MISO(7.25,1.728) MOSI(5.98,1.728) SCK(4.71,1.728)
oled-1.3-ssd1306
  round 1.8 hole 1.05: GND(10.19,-1.27) SCL(15.27,-1.27) SDA(17.81,-1.27) VCC(12.73,-1.27)
R0603
  rect 0.806x0.864 smd: 1(-0.753,0) 2(0.753,0)
SOD-323_L1.8-W1.3-LS2.5-RD
  rect 1x0.75 smd: 1(-1.173,0) 2(1.173,0)
SOP-8_L4.9-W3.9-P1.27-LS6.0-BL
  oval 0.63x1.865 smd: 1(-1.905,-2.683) 2(-0.635,-2.683) 3(0.635,-2.683) 4(1.905,-2.683) 5(1.905,2.683) 6(0.635,2.683) 7(-0.635,2.683) 8(-1.905,2.683)
SOT-223-3_L6.5-W3.4-P2.30-LS7.0-BR
  rect 2.5x1.1 smd: 1(2.97,-2.3) 2(2.97,0) 3(2.97,2.3)
  rect 2.34x3.6 smd: 4(-2.97,0)
SOT-223_L6.5-W3.5-P2.30-LS7.0-BR
  rect 2.465x1.05 smd: 1(2.857,-2.3) 2(2.857,0) 3(2.857,2.3)
  rect 2.465x3.54 smd: 4(-2.857,0)
SW-SMD_SS-3292S-L2-B
  rect 0.9x1.25 smd: 1(-2.3,1.587) 2(0.7,1.587) 3(2.2,1.587)
  rect 0.9x0.9 smd: EH(-3.8,0.613) EH(-3.8,-1.587) EH(3.8,0.613) EH(3.8,-1.587)
SW-TH_SS-12M12G5
  oval 1.9x2.6 hole 1.2x1.9: 1(-4.7,0) 2(0,0) 3(4.7,0)
USB-C-SMD_KH-TYPE-C-16P
  oval 1.2x2 hole 0.7x1.7: 1(-4.32,1.765) 2(4.32,1.765)
  oval 1.2x1.8 hole 0.7x1.4: 3(-4.32,-2.415) 4(4.32,-2.415)
  rect 0.3x1.3 smd: A1(-3.35,2.415) A4(-2.55,2.415) A5(-1.25,2.415) A6(-0.25,2.415) A7(0.25,2.415) A8(1.25,2.415) A9(2.55,2.415) A12(3.35,2.415) B1(3.05,2.415) B4(2.25,2.415) B5(1.75,2.415) B6(0.75,2.415) B7(-0.75,2.415) B8(-1.75,2.415) B9(-2.25,2.415) B12(-3.05,2.415)

## Nets
As in the schematic.

Pads without a net: U4 2 8 9; U5 4; USB1 A5 A8 B5 B8

## Via types
v1: diameter 0.5, hole 0.299, Top Layer to Bottom Layer, 2 vias
v2: diameter 0.5, hole 0.3, Top Layer to Bottom Layer, 204 vias
v3: diameter 0.508, hole 0.3, Top Layer to Bottom Layer, 21 vias

## Routing (per net, layer and track width the routed paths; a pad name or vN(x,y) marks a point on that pad's centre or on a via; arc(x,y) is an arc through that point)
+3.3V: length 152.6
  Top Layer w0.508: C9.2 55.19,21.88 54.81,22.26 54.81,23.17 55.19,23.55 U5.8 57.1,23.55 57.98,24.44 57.98,26.84 57.46,27.36 ; v3(42.51,24.83) U2.2 U2.4 42.51,34.35 43.27,35.11 45.85,35.11 v3(47.89,33.08) 53.61,27.36 U5.5 ; v3(43.81,21.19) 42.93,22.08 42.07,22.08 R1.2 ; 57.46,27.36 57.22,27.37 57.34,27.37 57.46,27.36 ; 11.43,7.57 9.44,7.57 8.55,8.45 8.55,15.53 9.44,16.42 30.77,16.42 32.05,15.14 35.85,15.14 37.97,17.26 v3(37.97,18.39) v3(42.42,18.39) ; v3(36.96,22.08) 36.07,22.97 32.26,22.97 31.5,23.73 31.5,26.01 31.88,26.4 C4.2 34.83,26.4 C3.2
  Bottom Layer w0.508: 17.38,37.97 17.38,39.7 19.16,41.48 46.36,41.48 47.89,39.95 v3(47.89,33.08) ; v3(42.51,24.83) 43.81,23.52 v3(43.81,21.19) 43.81,19.79 v3(42.42,18.39) ; v3(36.96,22.08) 36.96,19.41 v3(37.97,18.39)
+5V: length 106.1
  Top Layer w0.305: USB1.B4 68.95,24.79 70.05,23.7 70.05,21.44 68.91,20.29 USB1.B9 66.5,20.29 66.14,19.94 U3.4
  Top Layer w0.508: C2.2 49.02,24.7 C1.2 49.05,23.81 48.41,23.18 46.74,23.18 v3(46.11,23.81) 44.81,25.11 U2.3 ; C8.2 55.44,16.86 C7.2 52.49,16.86 v3(51.06,15.43) 52.46,14.03 60.26,14.03 U3.2 U3.4 ; 11.43,2.49 v3(15.19,2.49)
  Bottom Layer w0.508: v3(46.11,23.81) 46.11,18.22 48.9,15.43 v3(51.06,15.43) 51.06,9.41 44.14,2.49 v3(15.19,2.49)
GND: length 89.9
  Top Layer w0.203: v3(68.57,7.43) SW2.EH SW2.EH 68.58,4.13 68.58,3.36 68.07,2.86 61.6,2.86 60.97,3.49 SW2.EH SW2.EH 60.97,6.92 61.35,7.3 62.46,7.3 SW2.1
  Top Layer w0.508: USB1.1 68.07,18.87 USB1.A1 ; C4.1 36.35,27.8 37.67,29.11 39.57,29.11 40.21,28.47 U2.1 40.21,24.84 41.09,23.95 44.14,23.95 45.79,22.3 49.1,22.3 50.45,23.65 C1.1 50.45,26.59 C2.1 v2(50.42,28.4) ; C6.1 55.45,9.85 C5.1 57.45,9.87 v3(57.76,10.17) ; USB1.2 68.07,26.21 USB1.A12 ; v2(63.95,26.09) U5.3 60.27,26.09 59.85,25.67 C9.1 59.85,21.13 59.33,20.61 52.74,20.61 52.11,19.97 52.11,18.77 52.62,18.26 C7.1 55.44,18.26 C8.1 56.4,18.28 58.48,16.19 60.4,16.19 U3.1 ; 33.87,6.25 v3(38.95,6.25) ; 11.43,5.03 v2(6.73,5.03)
  vias: v2(14.64,20.86) v2(14.64,19.59) v2(14.64,14.51) v2(14.64,13.24) v2(14.64,11.97) v2(14.64,10.7) v2(14.64,9.43) v2(14.64,8.16) v2(14.64,6.89) v2(14.64,5.62) v2(14.64,4.35) v2(14.64,1.81) v2(15.28,21.5) v2(15.28,20.23) v2(15.28,17.69) v2(15.28,15.15) v2(15.28,13.88) v2(15.28,11.34) v2(15.28,8.8) v2(15.28,7.53) v2(15.28,6.26) v2(15.28,4.99) v2(15.28,3.72) v2(15.28,1.18) v2(15.91,22.13) v2(15.91,22.13) v2(15.91,20.86) v2(15.91,18.32) v2(15.91,14.51) v2(15.91,13.24) v2(15.91,11.97) v2(15.91,9.43) v2(15.91,8.16) v2(15.91,6.89) v2(15.91,5.62) v2(15.91,4.35) v2(16.55,21.5) v2(16.55,18.96) v2(16.55,17.69) v2(16.55,15.15) v2(16.55,13.88) v2(16.55,10.07) v2(16.55,8.8) v2(16.55,7.53) v2(16.55,6.26) v2(16.55,4.99) v2(16.55,3.72) v2(16.55,1.18) v2(17.18,22.13) v2(17.18,19.59) v2(17.18,18.32) v2(17.18,14.51) v2(17.18,13.24) v2(17.18,10.7) v2(17.18,9.43) v2(17.18,8.16) v2(17.18,6.89) v2(17.18,5.62) v2(17.18,4.35) v2(17.82,20.23) v2(17.82,18.96) v2(17.82,17.69) v2(17.82,15.15) v2(17.82,13.88) v2(17.82,10.07) v2(17.82,8.8) v2(17.82,7.53) v2(17.82,6.26) v2(17.82,4.99) v2(17.82,3.72) v2(17.82,1.18) v2(18.45,20.86) v2(18.45,19.59) v2(18.45,18.32) v2(18.45,14.51) v2(18.45,13.24) v2(18.45,10.7) v2(18.45,9.43) v2(18.45,8.16) v2(18.45,6.89) v2(18.45,5.62) v2(18.45,4.35) v2(19.09,21.5) v2(19.09,20.23) v2(19.09,18.96) v2(19.09,17.69) v2(19.09,15.15) v2(19.09,13.88) v2(19.09,10.07) v2(19.09,8.8) v2(19.09,7.53) v2(19.09,6.26) v2(19.09,4.99) v2(19.09,3.72) v2(19.09,1.18) v2(19.72,22.13) v2(19.72,20.86) v2(19.72,19.59) v2(19.72,18.32) v2(19.72,14.51) v2(19.72,13.24) v2(19.72,10.7) v2(19.72,9.43) v2(19.72,8.16) v2(19.72,6.89) v2(19.72,5.62) v2(19.72,4.35) v2(20.36,21.5) v2(20.36,20.23) v2(20.36,18.96) v2(20.36,17.69) v2(20.36,15.15) v2(20.36,13.88) v2(20.36,10.07) v2(20.36,8.8) v2(20.36,7.53) v2(20.36,6.26) v2(20.36,4.99) v2(20.36,3.72) v2(20.36,1.18) v2(20.99,22.13) v2(20.99,20.86) v2(20.99,19.59) v2(20.99,18.32) v2(20.99,14.51) v2(20.99,13.24) v2(20.99,10.7) v2(20.99,9.43) v2(20.99,8.16) v2(20.99,6.89) v2(20.99,5.62) v2(20.99,4.35) v2(21.63,21.5) v2(21.63,20.23) v2(21.63,18.96) v2(21.63,17.69) v2(21.63,15.15) v2(21.63,13.88) v2(21.63,10.07) v2(21.63,8.8) v2(21.63,7.53) v2(21.63,6.26) v2(21.63,4.99) v2(21.63,3.72) v2(21.63,1.18) v2(22.26,22.13) v2(22.26,20.86) v2(22.26,19.59) v2(22.26,18.32) v2(22.26,14.51) v2(22.26,13.24) v2(22.26,10.7) v2(22.26,9.43) v2(22.26,8.16) v2(22.26,6.89) v2(22.26,5.62) v2(22.26,4.35) v2(22.9,21.5) v2(22.9,20.23) v2(22.9,18.96) v2(22.9,17.69) v2(22.9,15.15) v2(22.9,13.88) v2(22.9,10.07) v2(22.9,8.8) v2(22.9,7.53) v2(22.9,6.26) v2(22.9,4.99) v2(22.9,3.72) v2(22.9,1.18) v2(23.53,22.13) v2(23.53,20.86) v2(23.53,19.59) v2(23.53,18.32) v2(23.53,14.51) v2(23.53,13.24) v2(23.53,10.7) v2(23.53,9.43) v2(23.53,8.16) v2(23.53,6.89) v2(23.53,5.62) v2(23.53,4.35) v2(24.17,21.5) v2(24.17,17.69) v2(24.17,15.15) v2(24.17,1.18) v2(24.8,22.13) v2(65.02,42.1) v2(65.02,39.56) v2(65.02,37.02) v2(67.06,44.13) v2(67.06,34.99) v2(69.47,44.13) v2(69.6,34.99) v2(72.14,44.13) v2(72.14,34.99) v2(74.17,42.1) v2(74.17,39.56) v2(74.17,37.02)
VCC: length 28.6
  Top Layer w0.508: U3.3 v3(57.76,11.57) 57.46,11.27 C5.2 55.45,11.25 C6.2
  Bottom Layer w0.508: SW1.2 57.76,30.49 v3(57.76,11.57)
CE: length 10.7
  Top Layer w0.203: 33.87,13.87 33.8,13.8 32.37,13.8 29.83,11.26 29.83,7.81 29.57,7.56 27.81,7.56
CSN: length 12.1
  Top Layer w0.203: 33.87,12.6 33.8,12.53 32.11,12.53 30.59,11 30.59,6.03 29.57,5.02 27.81,5.02
IRQ: length 35.3
  Top Layer w0.203: 33.87,7.52 58.34,7.52 60.14,9.32 65.95,9.32 66.97,8.31 SW2.3
MISO: length 40.2
  Top Layer w0.203: v3(15.24,12.65) 11.43,12.65 ; 33.87,8.79 v3(38.95,8.79)
  Bottom Layer w0.203: v3(15.24,12.65) 40.38,12.65 41.51,11.51 41.51,10.06 40.24,8.79 v3(38.95,8.79)
MODE: length 61.2
  Top Layer w0.203: 27.81,15.18 27.8,15.16 25.85,15.16 24.64,13.95 24.64,1.84 25.65,0.82 29.84,0.82 33.27,4.25 40.13,4.25 42.66,6.78 58.87,6.78 60.65,8.56 64.97,8.56 65.48,8.05 65.48,7.32 SW2.2
MOSI: length 37.1
  Top Layer w0.203: 33.87,10.06 v3(38.95,10.06) ; v3(15.24,10.11) 11.43,10.11
  Bottom Layer w0.203: v3(15.24,10.11) 16.65,11.51 39.99,11.51 40.5,11 40.5,10.57 39.99,10.06 v3(38.95,10.06)
RXD: length 21
  Top Layer w0.203: 27.81,17.72 25.78,17.72 24.64,18.86 24.64,20.89 25.78,22.03 27.44,22.03 28.33,22.92 28.33,27.88 31.43,30.99 D1.2
RXD340: length 49
  Top Layer w0.203: D1.1 31.43,35.56 35.85,39.97 v3(38.06,39.97) RXD1.1 ; v3(38.05,25.96) 38.05,24.82 39.57,23.29 43.19,23.29 44.97,21.51 50.64,21.51 55.22,26.09 U5.6
  Bottom Layer w0.203: v3(38.05,25.96) 38.06,25.98 v3(38.06,39.97)
SCK: length 13.5
  Top Layer w0.203: 33.87,11.33 33.8,11.26 31.86,11.26 31.35,10.75 31.35,4.25 29.57,2.48 27.81,2.48
SCL: length 22.3
  Top Layer w0.203: 11.43,20.27 13.32,20.27 19.92,26.87 19.92,37.97
SDA: length 26.4
  Top Layer w0.203: 11.43,17.73 14.05,17.73 22.5,26.18 22.5,37.97
TXD: length 38.2
  Top Layer w0.203: R2.2 36.56,20.4 35.43,21.53 v3(31.12,21.53) ; 27.81,20.26 29.84,20.26 v3(31.12,21.53) ; v3(31.12,21.53) 29.85,22.79 29.85,27.28 33.44,30.86 33.44,35.03 36.61,38.2 TXD1.1
TXD340: length 16.2
  Top Layer w0.203: U5.7 55.06,24.82 50.65,20.4 42,20.4
USB_D+: length 13.9
  Top Layer w0.203: USB1.B6 69,23.29 69.25,23.04 69.25,21.98 ; 69.25,21.98 68.94,22.29 USB1.A6 ; 69.25,21.98 v1(69.25,21.72) ; v1(65.38,23.55) U5.1
  Bottom Layer w0.203: v1(69.25,21.72) 68.74,21.21 66.84,21.21 66.2,21.84 66.2,22.73 66.46,22.99 66.46,23.29 66.2,23.55 v1(65.38,23.55)
USB_D-: length 10
  Top Layer w0.203: 67.09,22.79 67.09,23.88 66.15,24.82 U5.2 ; 67.09,22.79 66.84,22.54 66.84,22.05 67.09,21.79 USB1.B7 ; 67.09,22.79 USB1.A7
$1N20954: length 15.8
  Bottom Layer w1.27: 4.14,29.08 4.14,13.28
$1N23859: length 34.4
  Bottom Layer w0.508: 66,14.61 66,17.4 64.98,18.42 60.41,18.42 59.4,19.43 59.4,30.73 58.38,31.75 58.38,34.29 57.36,35.31 54.09,35.31 SW1.1
$1N25890: length 36.5
  Top Layer w0.203: v2(37.16,24.46) 39.58,22.03 R1.1 ; 44.65,39.09 43.76,38.2 TXD1.2 ; RXD1.2 43.76,39.98 v3(44.65,39.09) 46.36,39.09 47,38.46 47,36.89 46.35,36.25 37.28,36.25 35.51,34.47 v2(35.51,30.4)
  Bottom Layer w0.203: v2(37.16,24.46) 37.16,28.75 v2(35.51,30.4)

## Copper pours and planes (outline as drawn; the poured copper is in the pictures)
GND on Bottom Layer: 0,45.01 75,45.01 75,0 0,0

Small or netless copper shapes (teardrops, artwork), in the pictures only: 121 on Top Layer, 16 on Bottom Layer

## Text on the board
Top Silkscreen Layer: BOOT | Normal
